# EAGLE design remote_pwr (EAGLE 7.5.0)
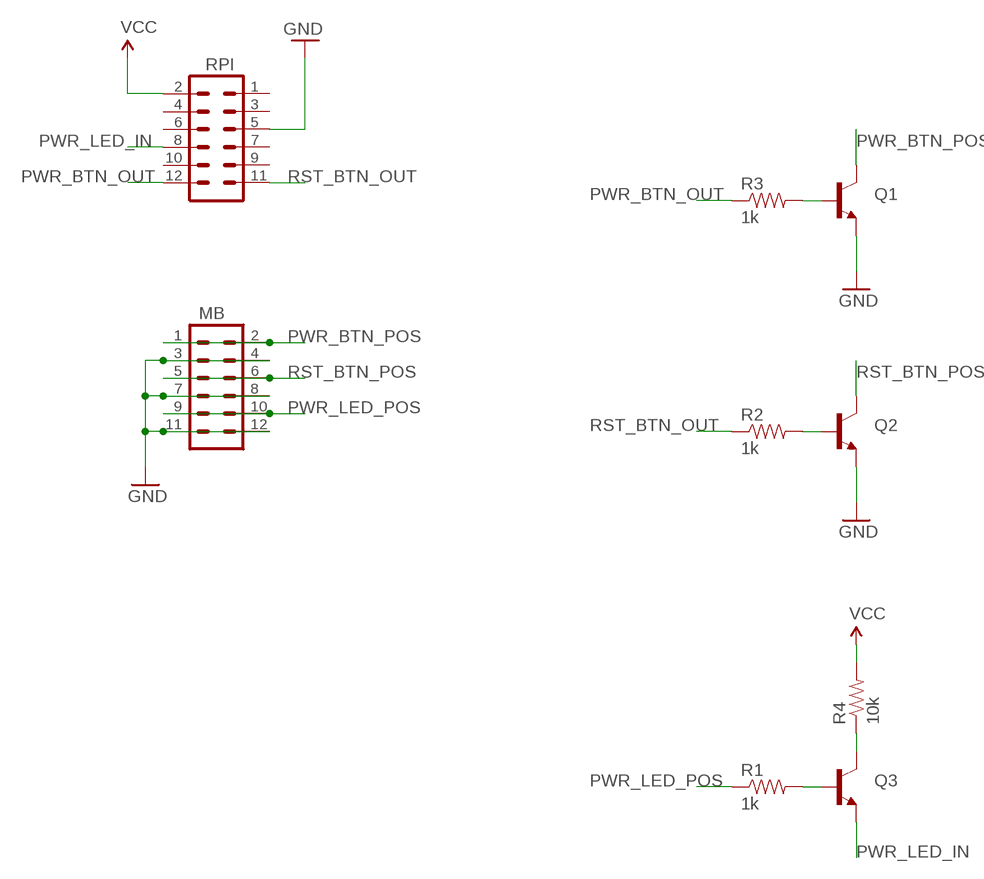
[diagram p0: schematic, sheet 1]

## Parts
MB  M06X2PTH_FEMALE  [2X6]
Q1  TRANSISTOR_NPNTO-92-AMMO  [TO-92-AMMO]
Q2  TRANSISTOR_NPNTO-92-AMMO  [TO-92-AMMO]
Q3  TRANSISTOR_NPNTO-92-AMMO  [TO-92-AMMO]
R1  1k  RESISTORAXIAL-0.3  [AXIAL-0.3]
R2  1k  RESISTORAXIAL-0.3  [AXIAL-0.3]
R3  1k  RESISTORAXIAL-0.3  [AXIAL-0.3]
R4  10k  RESISTORAXIAL-0.3  [AXIAL-0.3]
RPI  M06X2PTH_FEMALE  [2X6]

## Nets
GND: MB.3 MB.4 MB.7 MB.8 MB.11 MB.12 Q1.1(E) Q2.1(E) RPI.5
N$1: Q3.3(C) R4.P$1
N$2: Q1.2(B) R3.P$2
N$3: Q2.2(B) R2.P$2
N$4: Q3.2(B) R1.P$2
PWR_BTN_OUT: R3.P$1 RPI.12
PWR_BTN_POS: MB.1 MB.2 Q1.3(C)
PWR_LED_IN: Q3.1(E) RPI.8
PWR_LED_POS: MB.9 MB.10 R1.P$1
RST_BTN_OUT: R2.P$1 RPI.11
RST_BTN_POS: MB.5 MB.6 Q2.3(C)
VCC: R4.P$2 RPI.2
Unconnected: RPI.1 RPI.3 RPI.4 RPI.6 RPI.7 RPI.9 RPI.10

## Library data of the parts
MB RPI = SparkFun-Connectors:M06X2; PROD_ID: CONN-12423; VALUE: 2X6 FEMALE
Q1-Q3 = SparkFun-DiscreteSemi:TRANSISTOR_NPN: Generic NPN BJT MMBT2222A - TRANS-08049 (SOT-23, 1A 40V) MPSA42 - TRANS-09116 (SOT-23, 500mA 300V) MMBT5088LT1G - TRANS-11160 (SOT-23, 50 mA 30V) BC547 - COM-08928 <http://www.sparkfun.com/products/8928> (TO-92 45V 100mA) (1.Collector 2.Base 3.Emitter) 2N3904 - COM-00521 <http://www.sparkfun.com/products/521> (TO-92 40V 200mA) (1.Emitter 2.Base 3.Collector) P2N2222A - COM-12852 <http://www.sparkfun.com/products/12852> (TO-92 40V 600mA) (1.Collector 2.Base 3.Emitter)
R1-R4 = SparkFun-Passives:RESISTOR: Resistor Basic schematic elements and footprints for 0603, 1206, and PTH resistors.

## Board
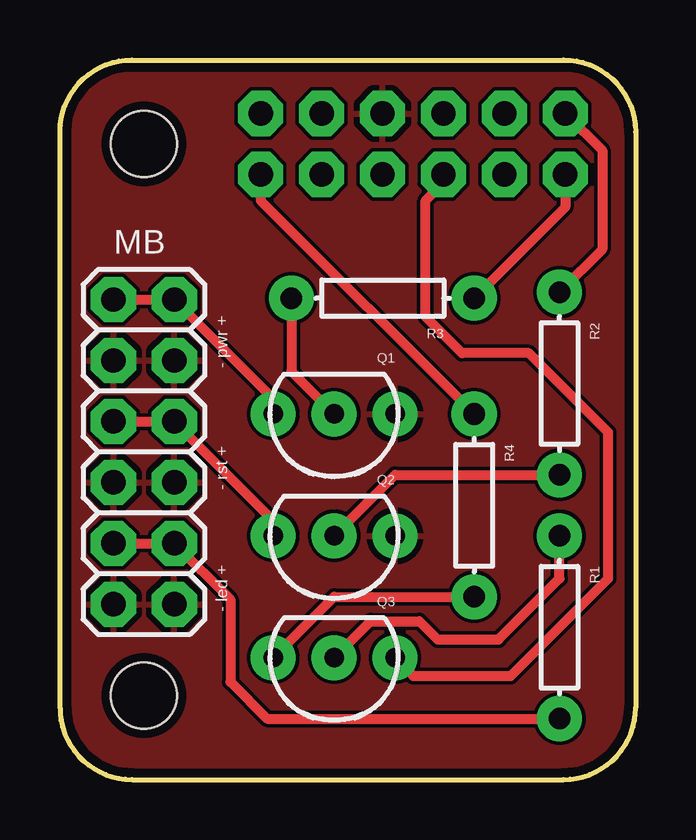
[diagram p1: board, top side]
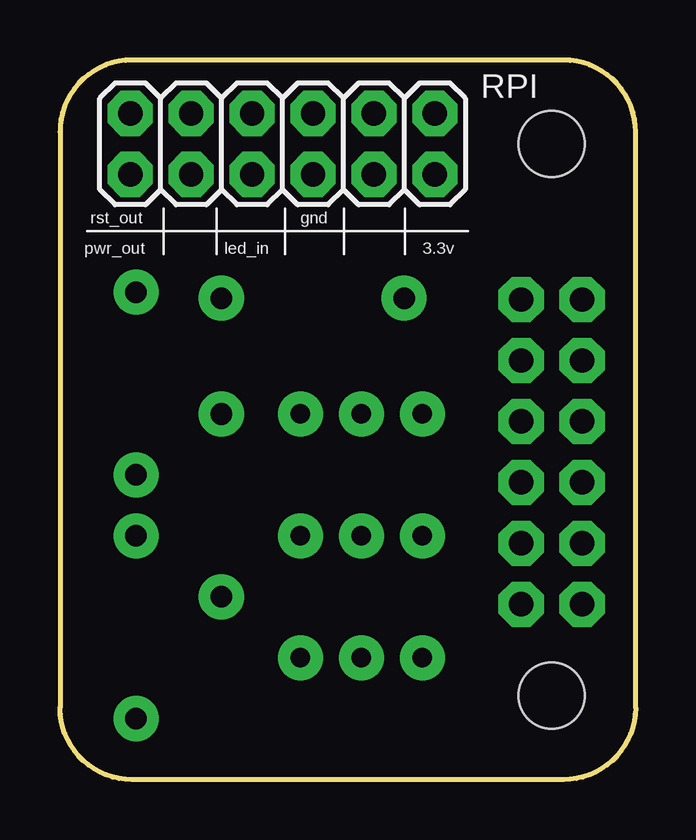
[diagram p2: board, bottom side, seen from below]

Size 24 x 30 mm. Coordinates in mm from the lower left corner, seen from the top.
Outline: 0,3 0,27 arc-90 3,30 21,30 arc-90 24,27 24,3 arc-90 21,0 3,0 arc-90 0,3
Copper layers (1*16): Top 0.0356mm / dielectric 1.5011mm / Bottom 0.0356mm
Design rules "LaenPCBOrder": minimum track width 6mil, minimum drill 13mil, track to track 6mil, track to pad 6mil, pad to pad 6mil, via to via 6mil, smd to smd 6mil, copper to edge 15mil, drill to drill 6mil, minimum pad ring 7mil, minimum via ring 7mil, stop-mask expansion 3mil, vias tented up to drill 0mil, thermal gap 10mil
Holes 2.75 mm at 3.5,3.5 3.5,26.5

### Footprints (pad centres in the part's own frame; a part is rotated, then mirrored left to right if it is on the bottom)
2X6 = drill 1.016 pad 1.88 octagon: 1 0,0; 2 0,2.54; 3 2.54,0; 4 2.54,2.54; 5 5.08,0; 6 5.08,2.54; 7 7.62,0; 8 7.62,2.54; 9 10.16,0; 10 10.16,2.54; 11 12.7,0; 12 12.7,2.54
TO-92-AMMO = drill 0.813 pad 1.88: 1 -2.54,0; 2 0,0; 3 2.54,0
AXIAL-0.3 = drill 0.9 pad 1.88: P$1 -3.81,0; P$2 3.81,0

### Placement (x,y rotation side)
MB  2.23,20.01 270 top
Q1  11.43,15.24 180 top
Q2  11.43,10.16 180 top
Q3  11.43,5.08 180 top
R1  20.83,6.35 90 top
R2  20.83,16.51 270 top
R3  13.46,20.07 180 top
R4  17.27,11.43 90 top
RPI  8.37,27.77 180 bottom

### Tracks (layer width: path | path; a pad name or v marks a point on that pad's centre or on a via)
GND
  pour Top: 0,0 0,29.21 0,29.84 24.13,29.84 24.13,0
N$1
  Top 0.406: Q3.3 11.43,7.62 R4.P$1
N$2
  Top 0.406: R3.P$2 9.65,17.02 Q1.2
N$3
  Top 0.406: Q2.2 13.97,12.7 R2.P$2
N$4
  Top 0.406: Q3.2 12.95,6.6 14.99,6.6 15.75,5.84 18.29,5.84 20.83,8.38 R1.P$2
PWR_BTN_OUT
  Top 0.406: RPI.12 21.07,23.86 R3.P$1
PWR_BTN_POS
  Top 0.406: MB.1 MB.2 8.89,15.89 Q1.3
PWR_LED_IN
  Top 0.406: Q3.1 14.73,4.32 18.8,4.32 22.86,8.38 22.86,14.48 19.56,17.78 16.76,17.78 15.24,19.3 15.24,24.13 15.99,24.88 RPI.8
PWR_LED_POS
  Top 0.406: MB.9 MB.10 7.11,7.51 7.11,4.06 8.64,2.54 R1.P$1
RST_BTN_OUT
  Top 0.406: RPI.11 22.61,26.23 22.61,22.1 R2.P$1
RST_BTN_POS
  Top 0.406: MB.5 MB.6 8.89,10.81 Q2.3
VCC
  Top 0.406: RPI.2 8.37,24.14 R4.P$2

### Text on the board
tPlace: - pwr + | - rst + | - led +
bPlace: gnd | rst_out | 3.3v | led_in | pwr_out